# Altium schematic sheet CrawlerSch26_04_22 2.SchDoc
size D; SheetNumber: 1; SheetTotal: 1
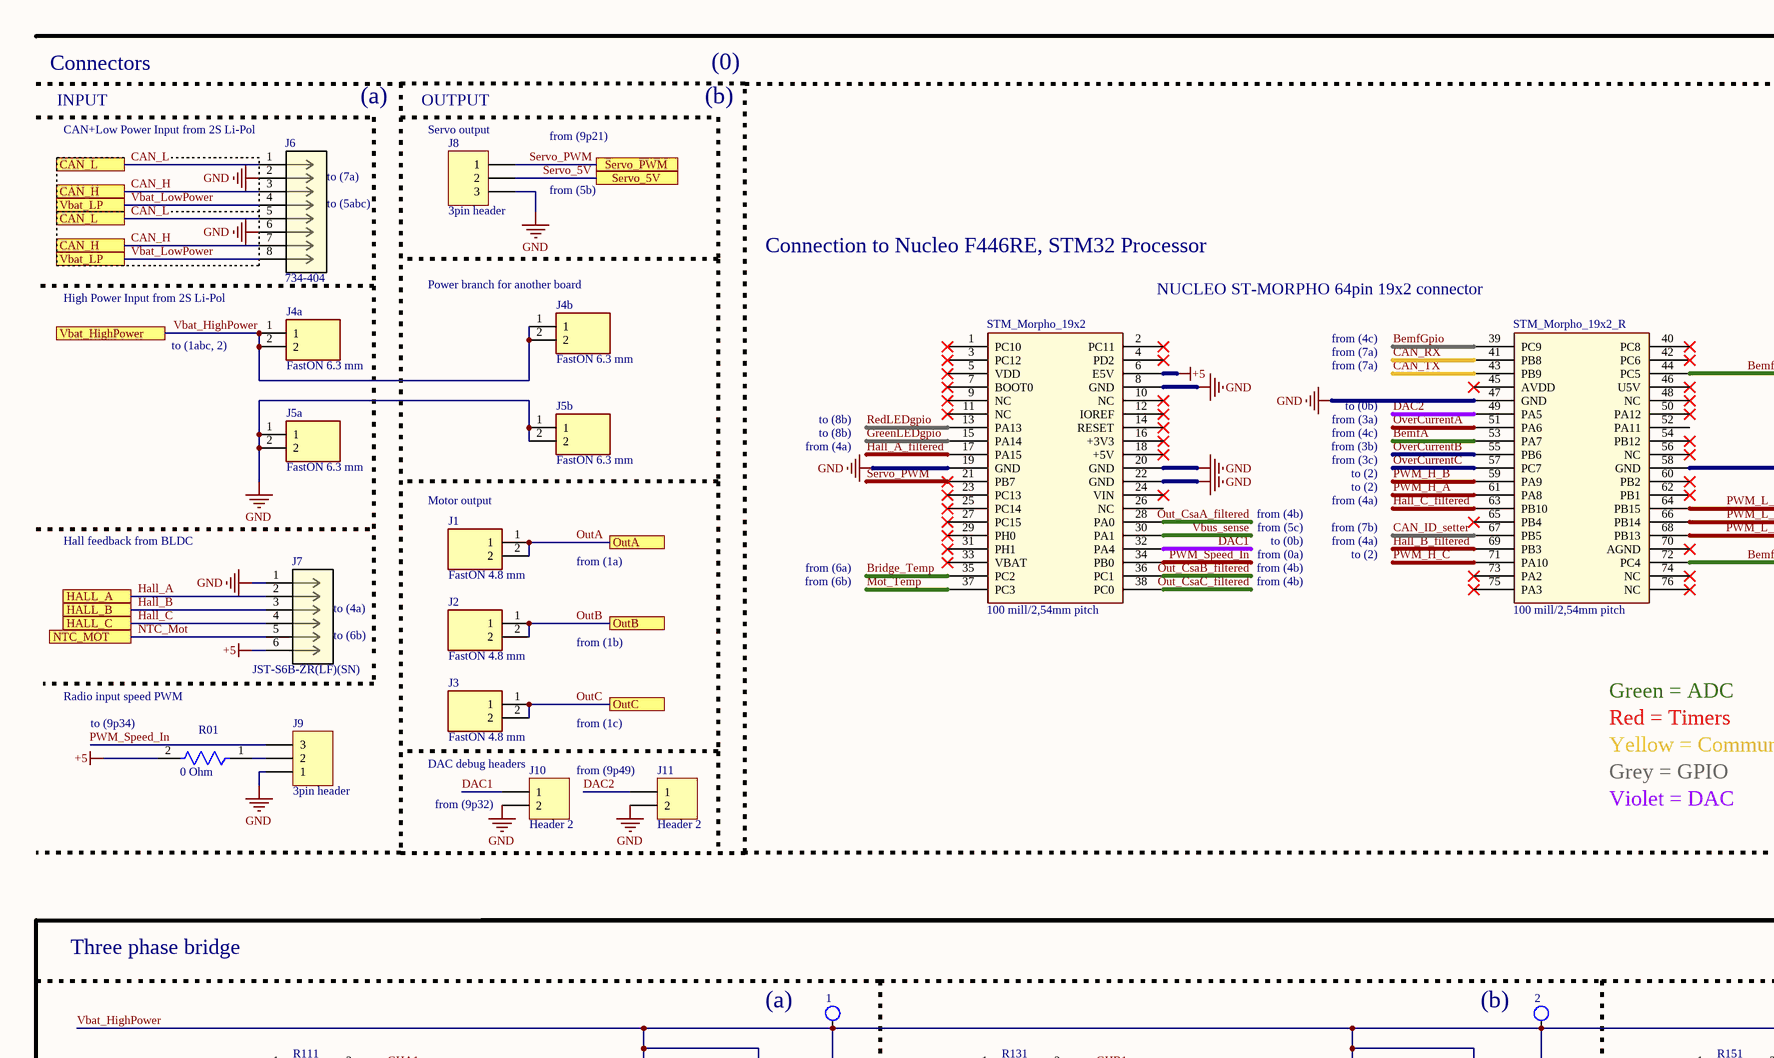
[diagram p0: CrawlerSch26_04_22 2.SchDoc, top left]
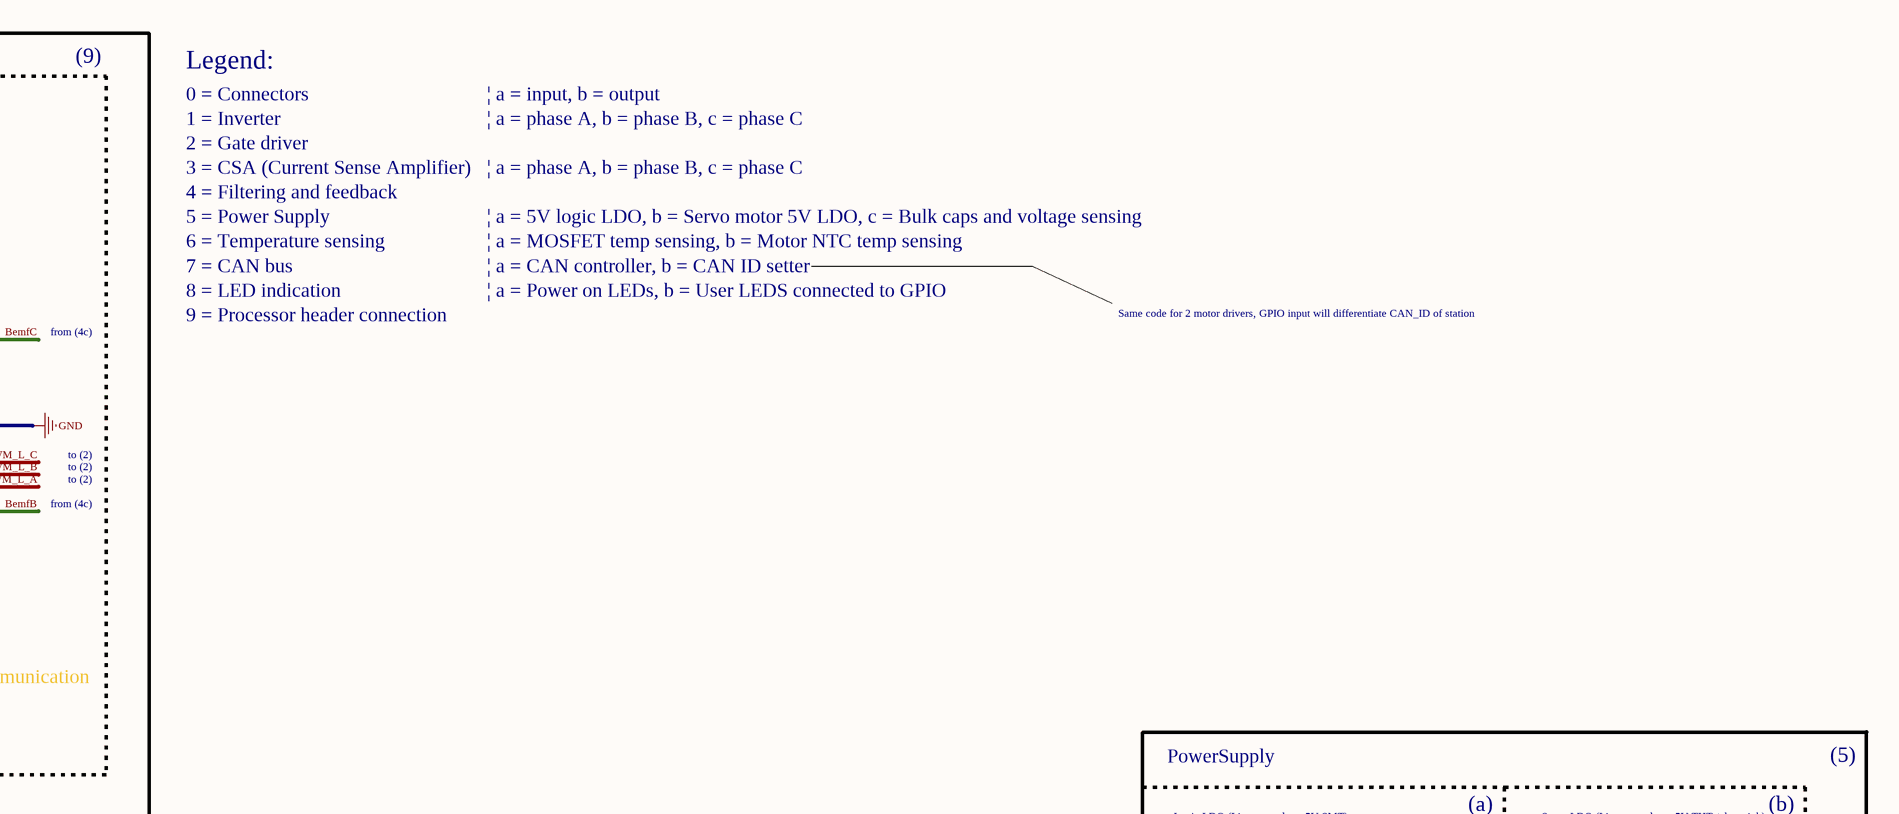
[diagram p1: CrawlerSch26_04_22 2.SchDoc, top right]
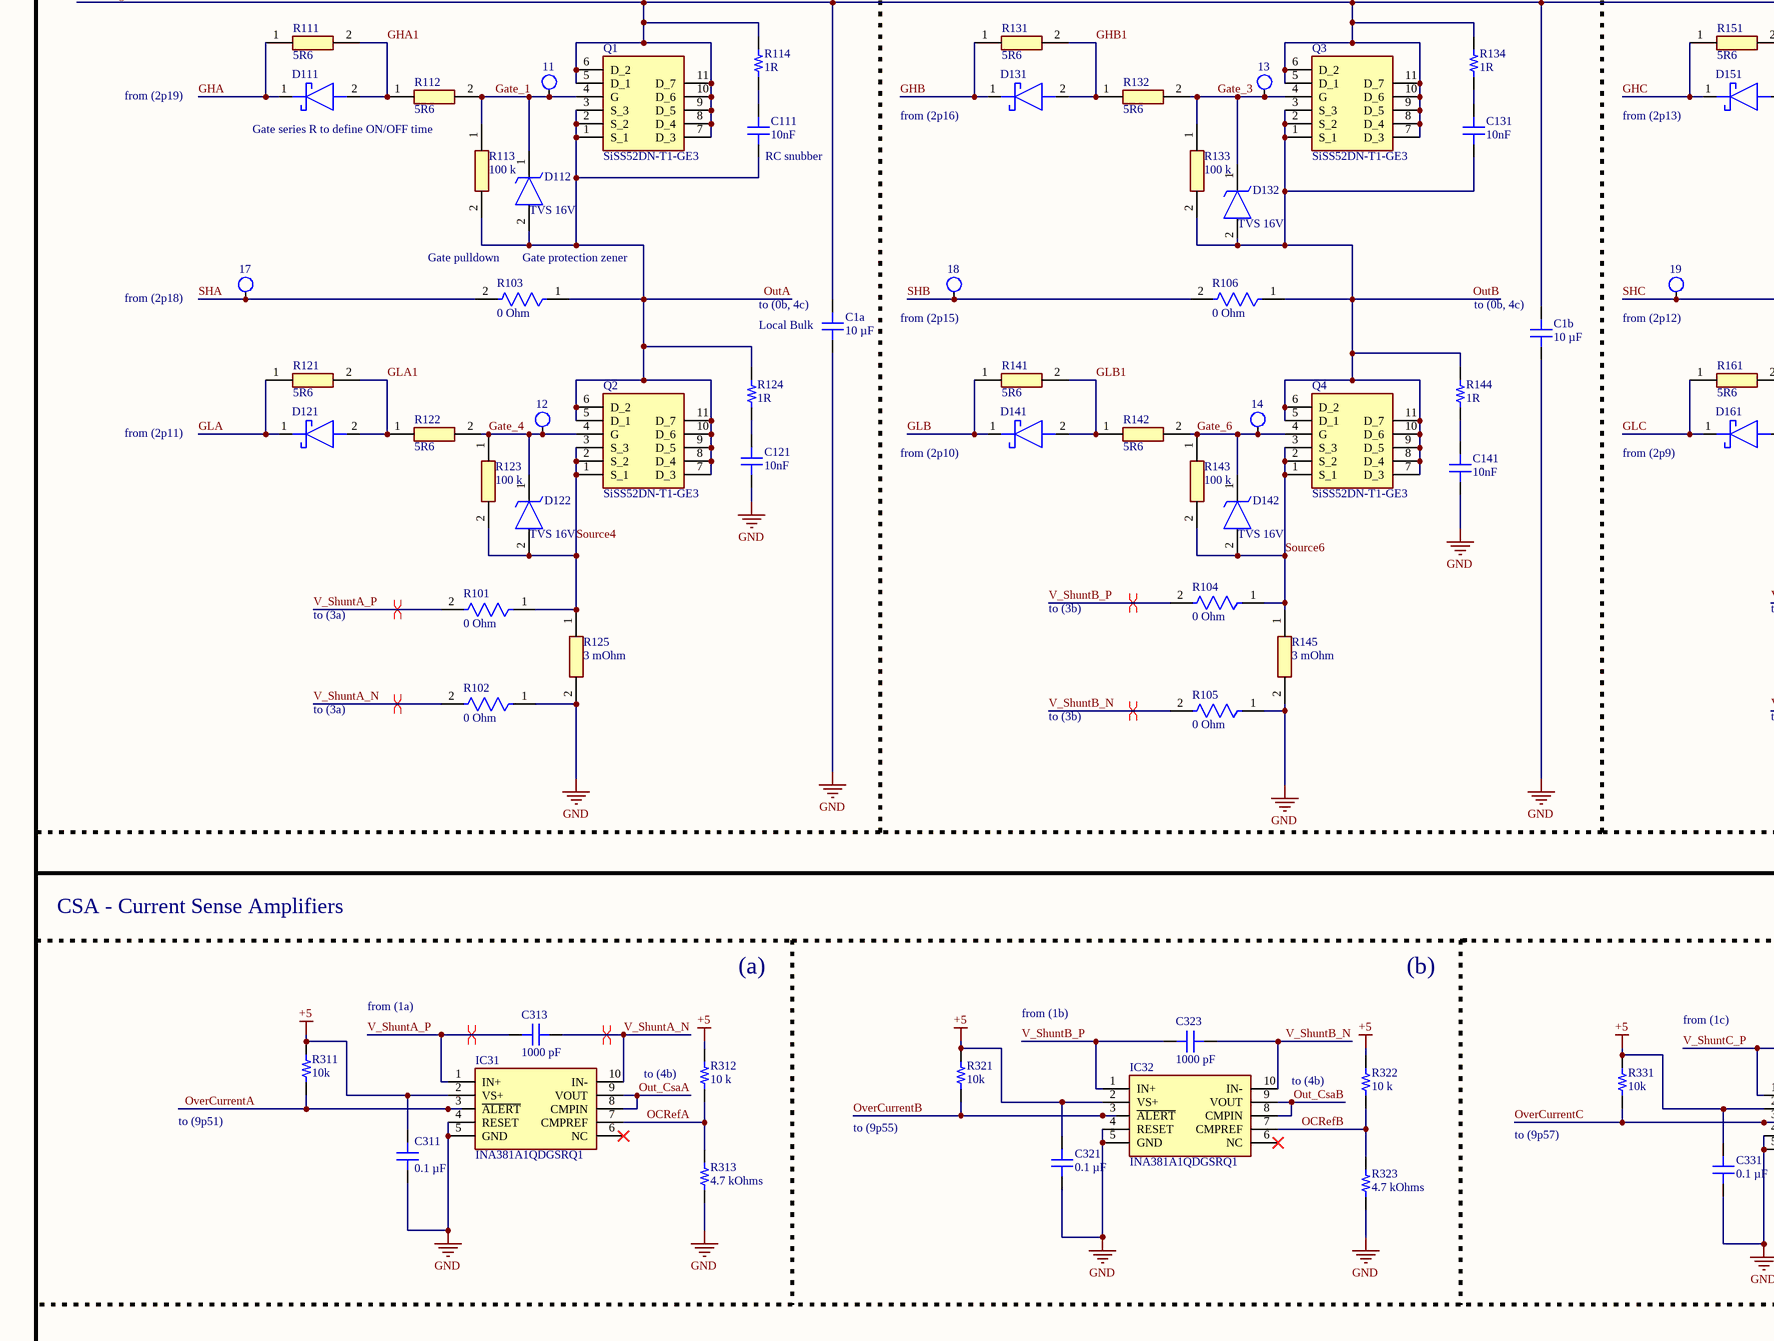
[diagram p2: CrawlerSch26_04_22 2.SchDoc, bottom left]
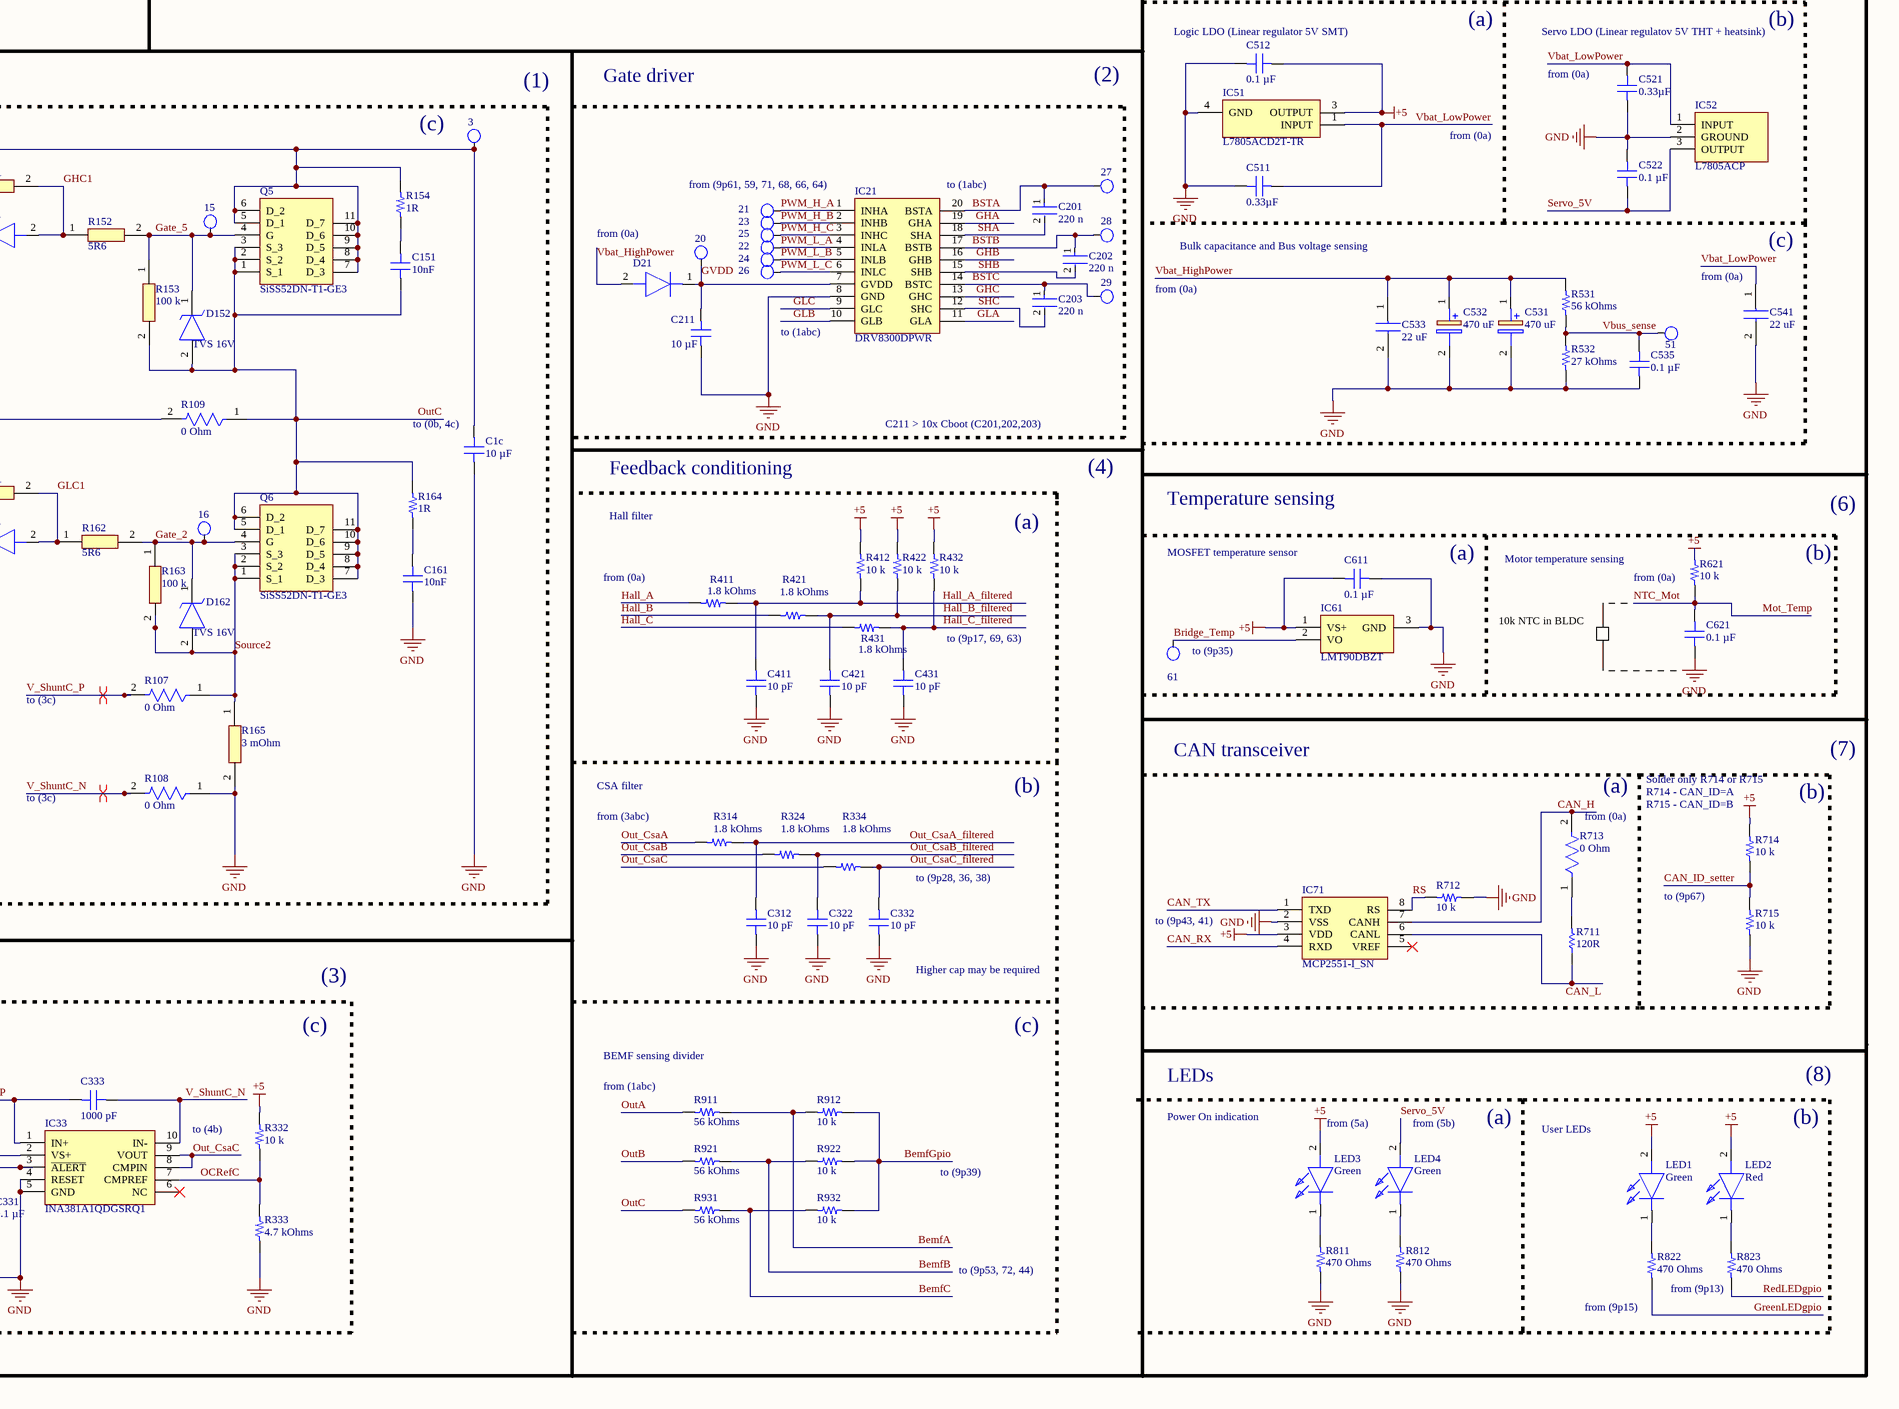
[diagram p3: CrawlerSch26_04_22 2.SchDoc, bottom right]

## Parts
1  TestPad  [TestPad]  (value not drawn)
2  TestPad  [TestPad]  (value not drawn)
3  TestPad  [TestPad]  (value not drawn)
11  TestPad  [TestPad]  (value not drawn)
12  TestPad  [TestPad]  (value not drawn)
13  TestPad  [TestPad]  (value not drawn)
14  TestPad  [TestPad]  (value not drawn)
15  TestPad  [TestPad]  (value not drawn)
16  TestPad  [TestPad]  (value not drawn)
17  TestPad  [TestPad]  (value not drawn)
18  TestPad  [TestPad]  (value not drawn)
19  TestPad  [TestPad]  (value not drawn)
20  TestPad  [TestPad]  (value not drawn)
21  TestPad  [TestPad]  (value not drawn)
22  TestPad  [TestPad]  (value not drawn)
23  TestPad  [TestPad]  (value not drawn)
24  TestPad  [TestPad]  (value not drawn)
25  TestPad  [TestPad]  (value not drawn)
26  TestPad  [TestPad]  (value not drawn)
27  TestPad  [TestPad]  (value not drawn)
28  TestPad  [TestPad]  (value not drawn)
29  TestPad  [TestPad]  (value not drawn)
51  TestPad  [TestPad]  (value not drawn)
61  TestPad  [TestPad]  (value not drawn)
C1a  10 µF  [CAP 0805_2012]
C1b  10 µF  [CAP 0805_2012]
C1c  10 µF  [CAP 0805_2012]
C111  10nF  [CAP 0805_2012]
C121  10nF  [CAP 0805_2012]
C131  10nF  [CAP 0805_2012]
C141  10nF  [CAP 0805_2012]
C151  10nF  [CAP 0805_2012]
C161  10nF  [CAP 0805_2012]
C201  220 n  [FP-CC0603-DA-MFG]
C202  220 n  [FP-CC0603-DA-MFG]
C203  220 n  [FP-CC0603-DA-MFG]
C211  10 µF  [CAP 0805_2012]
C311  value 0.1 µF  [CAP 0805_2012]
C312  10 pF  [CAP 0805_2012]
C313  1000 pF  [CAP 0805_2012]
C321  value 0.1 µF  [CAP 0805_2012]
C322  10 pF  [CAP 0805_2012]
C323  1000 pF  [CAP 0805_2012]
C331  value 0.1 µF  [CAP 0805_2012]
C332  10 pF  [CAP 0805_2012]
C333  1000 pF  [CAP 0805_2012]
C411  10 pF  [CAP 0805_2012]
C421  10 pF  [CAP 0805_2012]
C431  10 pF  [CAP 0805_2012]
C511  0.33µF  [CAP 0805_2012]
C512  value 0.1 µF  [CAP 0805_2012]
C521  0.33µF  [CAP 0805_2012]
C522  value 0.1 µF  [CAP 0805_2012]
C531  470 uF  [CAPPRD350W60D825H1300]
C532  470 uF  [CAPPRD350W60D825H1300]
C533  22 uF  [CAPC2012X145N]
C535  value 0.1 µF  [CAP 0805_2012]
C541  22 uF  [CAPC2012X145N]
C611  value 0.1 µF  [CAP 0805_2012]
C621  value 0.1 µF  [CAP 0805_2012]
D21  (no value)  [DIOM5226X220N]
D111  (no value)  [CUHS20F30H3F]
D112  TVS 16V  [SODFL1608X70N]
D121  (no value)  [CUHS20F30H3F]
D122  TVS 16V  [SODFL1608X70N]
D131  (no value)  [CUHS20F30H3F]
D132  TVS 16V  [SODFL1608X70N]
D141  (no value)  [CUHS20F30H3F]
D142  TVS 16V  [SODFL1608X70N]
D151  (no value)  [CUHS20F30H3F]
D152  TVS 16V  [SODFL1608X70N]
D161  (no value)  [CUHS20F30H3F]
D162  TVS 16V  [SODFL1608X70N]
IC21  DRV8300DPWR  [SOP65P640X120-20N]
IC31  INA381A1QDGSRQ1  [SOP50P490X110-10N]
IC32  INA381A1QDGSRQ1  [SOP50P490X110-10N]
IC33  INA381A1QDGSRQ1  [SOP50P490X110-10N]
IC51  L7805ACD2T-TR  [D2PAK-STB35NF10T4]
IC52  L7805ACP  [TO255P460X1020X2030-3P]
IC61  LMT90DBZT  [SOT95P237X112-3N]
IC71  MCP2551-I_SN  [SOIC127P600X175-8N]
J1  FastON 4.8 mm  [12171561]
J2  FastON 4.8 mm  [12171561]
J3  FastON 4.8 mm  [12171561]
J4a  FastON 6.3 mm  [7263872]
J4b  FastON 6.3 mm  [7263872]
J5a  FastON 6.3 mm  [7263872]
J5b  FastON 6.3 mm  [7263872]
J6  734-404  [CONN8_734-404_WAG]
J7  JST-S6B-ZR(LF)(SN)  [JST-ZH-S6B]
J8  3pin header  [HDR1X3]
J9  3pin header  [HDR1X3]
J10  Header 2  [HDR1X2]
J11  Header 2  [HDR1X2]
LED1  Green  [LEDC1608X80N]
LED2  Red  [LEDC1608X80N]
LED3  Green  [LEDC1608X80N]
LED4  Green  [LEDC1608X80N]
Q1  SiSS52DN-T1-GE3  [SISS94DNT1GE3]
Q2  SiSS52DN-T1-GE3  [SISS94DNT1GE3]
Q3  SiSS52DN-T1-GE3  [SISS94DNT1GE3]
Q4  SiSS52DN-T1-GE3  [SISS94DNT1GE3]
Q5  SiSS52DN-T1-GE3  [SISS94DNT1GE3]
Q6  SiSS52DN-T1-GE3  [SISS94DNT1GE3]
R01  0 Ohm  [FP-CR0805-IPC_C]
R101  0 Ohm  [FP-CR0805-IPC_C]
R102  0 Ohm  [FP-CR0805-IPC_C]
R103  0 Ohm  [FP-CR0805-IPC_C]
R104  0 Ohm  [FP-CR0805-IPC_C]
R105  0 Ohm  [FP-CR0805-IPC_C]
R106  0 Ohm  [FP-CR0805-IPC_C]
R107  0 Ohm  [FP-CR0805-IPC_C]
R108  0 Ohm  [FP-CR0805-IPC_C]
R109  0 Ohm  [FP-CR0805-IPC_C]
R111  5R6  [ERJP06_(0805)]
R112  5R6  [ERJP06_(0805)]
R113  100 k  [RESC2012X50N]
R114  1R  [RES 0805_2012]
R121  5R6  [ERJP06_(0805)]
R122  5R6  [ERJP06_(0805)]
R123  100 k  [RESC2012X50N]
R124  1R  [RES 0805_2012]
R125  3 mOhm  [RESC6434X90N]
R131  5R6  [ERJP06_(0805)]
R132  5R6  [ERJP06_(0805)]
R133  100 k  [RESC2012X50N]
R134  1R  [RES 0805_2012]
R141  5R6  [ERJP06_(0805)]
R142  5R6  [ERJP06_(0805)]
R143  100 k  [RESC2012X50N]
R144  1R  [RES 0805_2012]
R145  3 mOhm  [RESC6434X90N]
R151  5R6  [ERJP06_(0805)]
R152  5R6  [ERJP06_(0805)]
R153  100 k  [RESC2012X50N]
R154  1R  [RES 0805_2012]
R161  5R6  [ERJP06_(0805)]
R162  5R6  [ERJP06_(0805)]
R163  100 k  [RESC2012X50N]
R164  1R  [RES 0805_2012]
R165  3 mOhm  [RESC6434X90N]
R311  10k  [RES 0805_2012]
R312  10 k  [RES 0805_2012]
R313  4.7 kOhms  [RES 0805_2012]
R314  1.8 kOhms  [RES 0805_2012]
R321  10k  [RES 0805_2012]
R322  10 k  [RES 0805_2012]
R323  4.7 kOhms  [RES 0805_2012]
R324  1.8 kOhms  [RES 0805_2012]
R331  10k  [RES 0805_2012]
R332  10 k  [RES 0805_2012]
R333  4.7 kOhms  [RES 0805_2012]
R334  1.8 kOhms  [RES 0805_2012]
R411  1.8 kOhms  [RES 0805_2012]
R412  10 k  [RES 0805_2012]
R421  1.8 kOhms  [RES 0805_2012]
R422  10 k  [RES 0805_2012]
R431  1.8 kOhms  [RES 0805_2012]
R432  10 k  [RES 0805_2012]
R531  56 kOhms  [RES 0805_2012]
R532  27 kOhms  [RES 0805_2012]
R621  10 k  [RES 0805_2012]
R711  120R  [RESC0805(2012)_M]
R712  10 k  [RES 0805_2012]
R713  0 Ohm  [FP-CR0805-IPC_C]
R714  10 k  [RES 0805_2012]
R715  10 k  [RES 0805_2012]
R811  470 Ohms  [RES 0805_2012]
R812  470 Ohms  [RES 0805_2012]
R822  470 Ohms  [RES 0805_2012]
R823  470 Ohms  [RES 0805_2012]
R911  56 kOhms  [RES 0805_2012]
R912  10 k  [RES 0805_2012]
R921  56 kOhms  [RES 0805_2012]
R922  10 k  [RES 0805_2012]
R931  56 kOhms  [RES 0805_2012]
R932  10 k  [RES 0805_2012]
STM_Morpho_19x2  100 mill/2,54mm pitch  [STM_Morpho19x2_L]
STM_Morpho_19x2_R  100 mill/2,54mm pitch  [STM_Morpho19x2_R]

## Ports
CAN_H, CAN_L, HALL_A, HALL_B, HALL_C, NTC_MOT, OutA, OutB, OutC, Servo_5V, Servo_PWM, Vbat_HighPower, Vbat_LP

## Nets
+5: C311.2 C321.2 C331.2 C512.2 C611.2 IC31.2(VS+) IC32.2(VS+) IC33.2(VS+) IC51.3(OUTPUT) IC61.1(VS+) IC71.3(VDD) J7.6 LED1.2(A) LED2.2(A) LED3.2(A) R01.2 R311.2 R312.2 R321.2 R322.2 R331.2 R332.2 R412.2 R422.2 R432.2 R621.2 R714.2 STM_Morpho_19x2.6(E5V)
GND: C1a.1 C1b.1 C1c.1 C121.1 C141.1 C161.1 C211.2 C311.1 C312.1 C321.1 C322.1 C331.1 C332.1 C411.1 C421.1 C431.1 C511.1 C512.1 C521.1 C522.2 C531.2(-) C532.2(-) C533.2 C535.1 C541.2 C611.1 C621.1 IC21.8(GND) IC31.4(RESET) IC31.5(GND) IC32.4(RESET) IC32.5(GND) IC33.4(RESET) IC33.5(GND) IC51.4(GND) IC52.2(GROUND) IC61.3(GND) IC71.2(VSS) J5a.1 J5a.2 J5b.1 J5b.2 J6.2 J6.6 J7.1 J8.3 J9.1 J10.2 J11.2 R102.1 R105.1 R108.1 R125.2 R145.2 R165.2 R313.1 R323.1 R333.1 R532.1 R712.2 R715.1 R811.1 R812.1 STM_Morpho_19x2.8(GND) STM_Morpho_19x2.19(GND) STM_Morpho_19x2.20(GND) STM_Morpho_19x2.22(GND) STM_Morpho_19x2_R.47(GND) STM_Morpho_19x2_R.58(GND)
BemfA: R911.2 R912.1 STM_Morpho_19x2_R.53(PA7)
BemfB: R921.2 R922.1 STM_Morpho_19x2_R.72(PC4)
BemfC: R931.2 R932.1 STM_Morpho_19x2_R.44(PC5)
BemfGpio: R912.2 R922.2 R932.2 STM_Morpho_19x2_R.39(PC9)
Bridge_Temp: 61.1 IC61.2(VO) STM_Morpho_19x2.35(PC2)
BSTA: 27.1 C201.1 IC21.20(BSTA)
BSTB: 28.1 C202.1 IC21.17(BSTB)
BSTC: 29.1 C203.1 IC21.14(BSTC)
CAN_H: IC71.7(CANH) J6.3 J6.7 R713.2 ; port CAN_H
CAN_ID_setter: R714.1 R715.2 STM_Morpho_19x2_R.67(PB5)
CAN_L: IC71.6(CANL) J6.1 J6.5 R711.1 ; port CAN_L
CAN_RX: IC71.4(RXD) STM_Morpho_19x2_R.41(PB8)
CAN_TX: IC71.1(TXD) STM_Morpho_19x2_R.43(PB9)
DAC1: J10.1 STM_Morpho_19x2.32(PA4)
DAC2: J11.1 STM_Morpho_19x2_R.49(PA5)
Gate_1: 11.1 D112.1(K) Q1.4(G) R112.2 R113.1
Gate_2: 16.1 D162.1(K) Q6.4(G) R162.2 R163.1
Gate_3: 13.1 D132.1(K) Q3.4(G) R132.2 R133.1
Gate_4: 12.1 D122.1(K) Q2.4(G) R122.2 R123.1
Gate_5: 15.1 D152.1(K) Q5.4(G) R152.2 R153.1
Gate_6: 14.1 D142.1(K) Q4.4(G) R142.2 R143.1
GHA: D111.1(K) IC21.19(GHA) R111.1
GHA1: D111.2(A) R111.2 R112.1
GHB: D131.1(K) IC21.16(GHB) R131.1
GHB1: D131.2(A) R131.2 R132.1
GHC: D151.1(K) IC21.13(GHC) R151.1
GHC1: D151.2(A) R151.2 R152.1
GLA: D121.1(K) IC21.11(GLA) R121.1
GLA1: D121.2(A) R121.2 R122.1
GLB: D141.1(K) IC21.10(GLB) R141.1
GLB1: D141.2(A) R141.2 R142.1
GLC: D161.1(K) IC21.9(GLC) R161.1
GLC1: D161.2(A) R161.2 R162.1
GreenLEDgpio: R822.1 STM_Morpho_19x2.15(PA14)
GVDD: 20.1 C211.1 D21.1(K) IC21.7(GVDD)
Hall_A: J7.2 R411.1 ; port HALL_A
Hall_A_filtered: C411.2 R411.2 R412.1 STM_Morpho_19x2.17(PA15)
Hall_B: J7.3 R421.1 ; port HALL_B
Hall_B_filtered: C421.2 R421.2 R422.1 STM_Morpho_19x2_R.69(PB3)
Hall_C: J7.4 R431.1 ; port HALL_C
Hall_C_filtered: C431.2 R431.2 R432.1 STM_Morpho_19x2_R.63(PB10)
Mot_Temp: C621.2 J7.5 R621.1 STM_Morpho_19x2.37(PC3) ; port NTC_MOT  [also labelled NTC_Mot]
OCRefA: IC31.7(CMPREF) R312.1 R313.2
OCRefB: IC32.7(CMPREF) R322.1 R323.2
OCRefC: IC33.7(CMPREF) R332.1 R333.2
Out_CsaA: IC31.8(CMPIN) IC31.9(VOUT) R314.1
Out_CsaA_filtered: C312.2 R314.2 STM_Morpho_19x2.28(PA0)
Out_CsaB: IC32.8(CMPIN) IC32.9(VOUT) R324.1
Out_CsaB_filtered: C322.2 R324.2 STM_Morpho_19x2.36(PC1)
Out_CsaC: IC33.8(CMPIN) IC33.9(VOUT) R334.1
Out_CsaC_filtered: C332.2 R334.2 STM_Morpho_19x2.38(PC0)
OutA: C111.1 D112.2(A) J1.1 J1.2 Q1.1(S_1) Q1.2(S_2) Q1.3(S_3) Q2.5(D_1) Q2.6(D_2) Q2.7(D_3) Q2.8(D_4) Q2.9(D_5) Q2.10(D_6) Q2.11(D_7) R103.1 R113.2 R124.2 R911.1 ; port OutA
OutB: C131.1 D132.2(A) J2.1 J2.2 Q3.1(S_1) Q3.2(S_2) Q3.3(S_3) Q4.5(D_1) Q4.6(D_2) Q4.7(D_3) Q4.8(D_4) Q4.9(D_5) Q4.10(D_6) Q4.11(D_7) R106.1 R133.2 R144.2 R921.1 ; port OutB
OutC: C151.1 D152.2(A) J3.1 J3.2 Q5.1(S_1) Q5.2(S_2) Q5.3(S_3) Q6.5(D_1) Q6.6(D_2) Q6.7(D_3) Q6.8(D_4) Q6.9(D_5) Q6.10(D_6) Q6.11(D_7) R109.1 R153.2 R164.2 R931.1 ; port OutC
OverCurrentA: IC31.3(~{ALERT}) R311.1 STM_Morpho_19x2_R.51(PA6)
OverCurrentB: IC32.3(~{ALERT}) R321.1 STM_Morpho_19x2_R.55(PB6)
OverCurrentC: IC33.3(~{ALERT}) R331.1 STM_Morpho_19x2_R.57(PC7)
PWM_H_A: 21.1 IC21.1(INHA) STM_Morpho_19x2_R.61(PA8)
PWM_H_B: 23.1 IC21.2(INHB) STM_Morpho_19x2_R.59(PA9)
PWM_H_C: 25.1 IC21.3(INHC) STM_Morpho_19x2_R.71(PA10)
PWM_L_A: 22.1 IC21.4(INLA) STM_Morpho_19x2_R.68(PB13)
PWM_L_B: 24.1 IC21.5(INLB) STM_Morpho_19x2_R.66(PB14)
PWM_L_C: 26.1 IC21.6(INLC) STM_Morpho_19x2_R.64(PB15)
PWM_Speed_In: J9.3 STM_Morpho_19x2.34(PB0)
RedLEDgpio: R823.1 STM_Morpho_19x2.13(PA13)
RS: IC71.8(RS) R712.1
Servo_5V: C522.1 IC52.3(OUTPUT) J8.2 LED4.2(A) ; port Servo_5V
Servo_PWM: J8.1 STM_Morpho_19x2.21(PB7) ; port Servo_PWM
SHA: 17.1 C201.2 IC21.18(SHA) R103.2
SHB: 18.1 C202.2 IC21.15(SHB) R106.2
SHC: 19.1 C203.2 IC21.12(SHC) R109.2
Source2: D162.2(A) Q6.1(S_1) Q6.2(S_2) Q6.3(S_3) R107.1 R163.2 R165.1
Source4: D122.2(A) Q2.1(S_1) Q2.2(S_2) Q2.3(S_3) R101.1 R123.2 R125.1
Source6: D142.2(A) Q4.1(S_1) Q4.2(S_2) Q4.3(S_3) R104.1 R143.2 R145.1
V_ShuntA_N: C313.1 IC31.10(IN-) R102.2
V_ShuntA_P: C313.2 IC31.1(IN+) R101.2
V_ShuntB_N: C323.1 IC32.10(IN-) R105.2
V_ShuntB_P: C323.2 IC32.1(IN+) R104.2
V_ShuntC_N: C333.1 IC33.10(IN-) R108.2
V_ShuntC_P: C333.2 IC33.1(IN+) R107.2
Vbat_HighPower: 1.1 2.1 3.1 C1a.2 C1b.2 C1c.2 C531.1(+) C532.1(+) C533.1 D21.2(A) J4a.1 J4a.2 J4b.1 J4b.2 Q1.5(D_1) Q1.6(D_2) Q1.7(D_3) Q1.8(D_4) Q1.9(D_5) Q1.10(D_6) Q1.11(D_7) Q3.5(D_1) Q3.6(D_2) Q3.7(D_3) Q3.8(D_4) Q3.9(D_5) Q3.10(D_6) Q3.11(D_7) Q5.5(D_1) Q5.6(D_2) Q5.7(D_3) Q5.8(D_4) Q5.9(D_5) Q5.10(D_6) Q5.11(D_7) R114.2 R134.2 R154.2 R531.2 ; port Vbat_HighPower
Vbat_LowPower: C511.2 C521.2 C541.1 IC51.1(INPUT) IC52.1(INPUT) J6.4 J6.8 ; port Vbat_LP
Vbus_sense: 51.1 C535.2 R531.1 R532.2 STM_Morpho_19x2.30(PA1)
NetC111_2: C111.2 R114.1
NetC121_2: C121.2 R124.1
NetC131_2: C131.2 R134.1
NetC141_2: C141.2 R144.1
NetC151_2: C151.2 R154.1
NetC161_2: C161.2 R164.1
NetJ9_2: J9.2 R01.1
NetLED1_1: LED1.1(K) R822.2
NetLED2_1: LED2.1(K) R823.2
NetLED3_1: LED3.1(K) R811.2
NetLED4_1: LED4.1(K) R812.2
NetR711_2: R711.2 R713.1

Not connected (* = marked no-connect by the designer): IC31 6(NC)*; IC32 6(NC)*; IC33 6(NC)*; IC71 5(VREF)*; STM_Morpho_19x2 1(PC10)* 2(PC11)* 3(PC12)* 4(PD2)* 5(VDD)* 7(BOOT0)* 9(NC)* 10(NC)* 11(NC)* 12(IOREF)* 14(RESET)* 16(+3V3)* 18(+5V)* 23(PC13)* 24(VIN)* 25(PC14)* 26(NC) 27(PC15)* 29(PH0)* 31(PH1)* 33(VBAT)*; STM_Morpho_19x2_R 40(PC8)* 42(PC6)* 45(AVDD)* 46(U5V)* 48(NC)* 50(PA12)* 52(PA11) 54(PB12)* 56(NC)* 60(PB2)* 62(PB1)* 65(PB4)* 70(AGND)* 73(PA2)* 74(NC)* 75(PA3)* 76(NC)*

## Layout directives
differential pair: V_ShuntA_N, V_ShuntA_P, V_ShuntB_N, V_ShuntB_P, V_ShuntC_N, V_ShuntC_P

## Notes on the sheet
- Connectors
- (0)
- (9)
- Legend:
- INPUT
- (near J6) CAN+Low Power Input from 2S Li-Pol
- (a)
- OUTPUT
- (near J8) Servo output
- from (9p21)
- (b)
- 0 = Connectors
- 1 = Inverter
- | a = phase A, b = phase B, c = phase C
- | a = input, b = output
- (near J6) to (7a)
- (near J6) to (5abc)
- from (5b)
- 2 = Gate driver
- 3 = CSA (Current Sense Amplifier)
- 4 = Filtering and feedback
- (near J4b) Power branch for another board
- Connection to Nucleo F446RE, STM32 Processor
- NUCLEO ST-MORPHO 64pin 19x2 connector
- 5 = Power Supply
- 6 = Temperature sensing
- | a = 5V logic LDO, b = Servo motor 5V LDO, c = Bulk caps and voltage sensing
- | a = MOSFET temp sensing, b = Motor NTC temp sensing
- High Power Input from 2S Li-Pol
- (near J4a) to (1abc, 2)
- from (7a)
- from (4c)
- 7 = CAN bus
- 8 = LED indication
- 9 = Processor header connection
- | a = CAN controller, b = CAN ID setter
- | a = Power on LEDs, b = User LEDS connected to GPIO
- Same code for 2 motor drivers, GPIO input will differentiate CAN_ID of station
- to (8b)
- from (3a)
- to (0b)
- from (4a)
- from (3b)
- from (3c)
- to (2)
- Hall feedback from BLDC
- (near J1) Motor output
- from (1a)
- from (4b)
- from (5c)
- from (0a)
- from (7b)
- (near J7) to (4a)
- from (6b)
- from (6a)
- Radio input speed PWM
- (near J7) to (6b)
- from (1b)
- Green = ADC
- (near R01) to (9p34)
- from (1c)
- Red = Timers
- Yellow = Communication
- (near J10) DAC debug headers
- (near J10) from (9p32)
- (near J11) from (9p49)
- Grey = GPIO
- Violet = DAC
- PowerSupply
- (5)
- Three phase bridge
- (1)
- Gate driver
- (2)
- (near C512) Logic LDO (Linear regulator 5V SMT)
- (near C521) Servo LDO (Linear regulatov 5V THT + heatsink)
- (near C521) from (0a)
- (near 1) (a)
- (near 2) (b)
- (near 3) (c)
- from (9p61, 59, 71, 68, 66, 64)
- (near IC21) to (1abc)
- from (2p19)
- Gate series R to define ON/OFF time
- (near D131) from (2p16)
- (near D151) from (2p13)
- Bulk capacitance and Bus voltage sensing
- (c)
- (near C111) RC snubber
- (near C541) from (0a)
- Gate pulldown
- Gate protection zener
- from (2p18)
- (near C1a) Local Bulk
- (near C1a) to (0b, 4c)
- (near 18) from (2p15)
- (near C1b) to (0b, 4c)
- (near 19) from (2p12)
- (near C1c) to (0b, 4c)
- C211 > 10x Cboot (C201,202,203)
- Feedback conditioning
- Hall filter
- (4)
- Temperature sensing
- (6)
- from (2p11)
- (near D141) from (2p10)
- (near D161) from (2p9)
- MOSFET temperature sensor
- Motor temperature sensing
- (near R621) from (0a)
- to (9p17, 69, 63)
- 10k NTC in BLDC
- to (3a)
- to (3b)
- to (3c)
- (near 61) to (9p35)
- CAN transceiver
- (7)
- CSA filter
- from (3abc)
- (near R713) from (0a)
- (near R713) (a)
- Solder only R714 or R715
- (near R714) R714 - CAN_ID=A
- (near R714) R715 - CAN_ID=B
- to (9p28, 36, 38)
- to (9p43, 41)
- to (9p67)
- CSA - Current Sense Amplifiers
- (3)
- (near C332) Higher cap may be required
- BEMF sensing divider
- (near R312) to (4b)
- to (4b)
- (near R911) from (1abc)
- Power On indication
- LEDs
- from (5a)
- (near LED4) from (5b)
- User LEDs
- (8)
- to (9p51)
- to (9p55)
- to (9p57)
- to (9p39)
- to (9p53, 72, 44)
- (near R822) from (9p15)
- (near R823) from (9p13)

## Library data of the parts
C1a C1b C1c C211 = TMK212BBJ106KG-T: CAP CER 10UF 25V X5R 0805; manufacturer: Taiyo Yuden; Tolerance: ±10%; Part Number: TMK212BBJ106KG-T; Value: 10 µF; Applications: SMPS Filtering; Capacitance: 10 µF; componentlink1description: Datasheet; componentlink1url: https://www.yuden.co.jp/productdata/catalog/mlcc01_e.pdf; componentlink2description: DigiKey Link; componentlink2url: https://www.digikey.com/en/products/detail/taiyo-yuden/TMK212BBJ106KG-T/2714163; Device Package: 0805 (2012 Metric); lastupdated: 12.04.2022 22:11:08; Lifecycle Status: Active; Minimum Order: 1; Mounting Type: Surface Mount, MLCC; Operating Temperature: -55°C ~ 85°C; Package / Case: 0805 (2012 Metric); packaging: TapeAndReel; partid: 38853; Part Status: Active; price: 0.04; series: M; Size / Dimension: 0.079" L x 0.049" W (2.00mm x 1.25mm); Supplier 1: DigiKey; Supplier Part Number 1: 587-2985-1-ND; Temperature Coefficient: X5R; Thickness (Max): 0.053" (1.35mm); Voltage - Rated: 25V
C111 C121 C131 C141 C151 C161 = C0805C103J5GEC7210: CAP CER 0805 10NF 50V C0G 5%; manufacturer: KEMET; Capacitance: 10000 pF; Temperature Coefficient: C0G, NP0; Part Number: C0805C103J5GEC7210; Value: 10nF; Applications: ESD Protection; componentlink1description: Datasheet; componentlink1url: https://api.kemet.com/component-edge/download/datasheet/C0805C103J5GEC7210.pdf; componentlink2description: DigiKey Link; componentlink2url: https://www.digikey.com/en/products/detail/kemet/C0805C103J5GEC7210/8645966; Device Package: 0805 (2012 Metric); Features: Low ESL; lastupdated: 31.03.2022 8:49:11; Lifecycle Status: Active; Minimum Order: 1; Mounting Type: Surface Mount, MLCC; Operating Temperature: -55°C ~ 125°C; Package / Case: 0805 (2012 Metric); packaging: TapeAndReel; partid: 32892; Part Status: Active; price: 0.05; series: ESD SMD Comm C0G; Size / Dimension: 0.079" L x 0.049" W (2.00mm x 1.25mm); Supplier 1: DigiKey; Supplier Part Number 1: 399-C0805C103J5GEC7210CT-ND; Thickness (Max): 0.039" (1.00mm); Tolerance: ±5%; Voltage - Rated: 50V
C201-C203 = CMP-03422-000928-1: CAP CER 0.22UF 25V X5R 0603; Manufacturer: YAGEO; Manufacturer Part Number: CC0603KRX5R8BB224; Capacitance: 220 nF; Value: 220 nF; Material: Ceramic; Tolerance: 0.1; Temperature Coefficient: 15%; Voltage: 25 V; Package: CC0603-DA; Footprint Url: http://www.yageo.com/exep/pages/download/literatures/UPY-C_GEN_24.pdf; ComponentLink2Description: Datasheet; Lead Free: Yes; Device Class L2: Capacitors; Mouser Description: Multilayer Ceramic Capacitors MLCC - SMD/SMT 220 nF; Temperature Range Low: -55°C; Temperature Range High: +125°C; Temperature Characteristic: X5R; Device Class L1: Passive Components; Temperature: -55°C to +125°C; Voltage Rating: 25 V; RoHS: TRUE; Octopart: https://octopart.com/cc0603krx5r8bb224-yageo-29183069; Height: 0.9mm; Automotive: No; Device Class L3: Ceramic Capacitors; Category: Cap; ComponentLink2URL: http://www.yageo.com/documents/recent/UPY-GPHC_X7R_6.3V-to-50V_18.pdf; Digikey Description: CAP CER 0.22UF 25V X5R 0603
C311 C321 C331 C512 C522 C535 C611 C621 = 885012207045: CAP CER 0.1UF 16V X7R 0805; manufacturer: Würth Elektronik; Tolerance: ±10%; Part Number: 885012207045; Applications: General Purpose; Capacitance: 0.1 µF; componentlink1description: Datasheet; componentlink1url: https://katalog.we-online.de/pbs/datasheet/885012207045.pdf; componentlink2description: DigiKey Link; componentlink2url: https://www.digikey.com/en/products/detail/würth-elektronik/885012207045/5453900; Device Package: 0805 (2012 Metric); lastupdated: 12.04.2022 22:11:04; Lifecycle Status: Active; Minimum Order: 1; Mounting Type: Surface Mount, MLCC; Operating Temperature: -55°C ~ 125°C; Package / Case: 0805 (2012 Metric); packaging: TapeAndReel; partid: 15395; Part Status: Active; price: 0.03; series: WCAP-CSGP; Size / Dimension: 0.079" L x 0.049" W (2.00mm x 1.25mm); Supplier 1: DigiKey; Supplier Part Number 1: 732-8045-1-ND; Temperature Coefficient: X7R; Thickness (Max): 0.035" (0.90mm); Voltage - Rated: 16V
C312 C322 C332 C411 C421 C431 = 885012007010: CAP CER 10PF 16V C0G/NP0 0805; manufacturer: Würth Elektronik; Temperature Coefficient: C0G, NP0; Tolerance: ±5%; Part Number: 885012007010; Value: 10 pF; Applications: General Purpose; Capacitance: 10 pF; componentlink1description: Datasheet; componentlink1url: https://katalog.we-online.de/pbs/datasheet/885012007010.pdf; componentlink2description: DigiKey Link; componentlink2url: https://www.digikey.com/en/products/detail/würth-elektronik/885012007010/5453669; Device Package: 0805 (2012 Metric); lastupdated: 02.04.2022 5:58:15; Lifecycle Status: Active; Minimum Order: 1; Mounting Type: Surface Mount, MLCC; Operating Temperature: -55°C ~ 125°C; Package / Case: 0805 (2012 Metric); packaging: TapeAndReel; partid: 12597; Part Status: Active; price: 0.03; series: WCAP-CSGP; Size / Dimension: 0.079" L x 0.049" W (2.00mm x 1.25mm); Supplier 1: DigiKey; Supplier Part Number 1: 732-7814-1-ND; Thickness (Max): 0.053" (1.35mm); Voltage - Rated: 16V
C313 C323 C333 = 885012207033: CAP CER 1000PF 16V X7R 0805; manufacturer: Würth Elektronik; Tolerance: ±10%; Part Number: 885012207033; Value: 1000 pF; Applications: General Purpose; Capacitance: 1000 pF; componentlink1description: Datasheet; componentlink1url: https://katalog.we-online.de/pbs/datasheet/885012207033.pdf; componentlink2description: DigiKey Link; componentlink2url: https://www.digikey.com/en/products/detail/würth-elektronik/885012207033/5453888; Device Package: 0805 (2012 Metric); lastupdated: 12.04.2022 22:11:16; Lifecycle Status: Active; Minimum Order: 1; Mounting Type: Surface Mount, MLCC; Operating Temperature: -55°C ~ 125°C; Package / Case: 0805 (2012 Metric); packaging: TapeAndReel; partid: 12259; Part Status: Active; price: 0.02; series: WCAP-CSGP; Size / Dimension: 0.079" L x 0.049" W (2.00mm x 1.25mm); Supplier 1: DigiKey; Supplier Part Number 1: 732-8033-1-ND; Temperature Coefficient: X7R; Thickness (Max): 0.035" (0.90mm); Voltage - Rated: 16V
C511 C521 = 0805YC334JAT2A: CAP CER 0.33UF 16V X7R 0805; manufacturer: AVX Corporation; Tolerance: ±5%; Part Number: 0805YC334JAT2A; Value: 0.33µF; Applications: General Purpose; Capacitance: 0.33µF; componentlink1description: Datasheet; componentlink1url: http://datasheets.avx.com/X7RDielectric.pdf; componentlink2description: DigiKey Link; componentlink2url: http://digikey.com/product-detail/en/avx-corporation/0805YC334JAT2A/478-5273-1-ND/1950940; Device Package: 0805 (2012 Metric); lastupdated: 02.09.2020 1:04:40; Lifecycle Status: Active; Minimum Order: 1; Mounting Type: Surface Mount, MLCC; Operating Temperature: -55°C ~ 125°C; Package / Case: 0805 (2012 Metric); packaging: TapeAndReel; partid: 3309; Part Status: Active; price: 0.15; series: -; Size / Dimension: 0.079" L x 0.049" W (2.01mm x 1.25mm); Supplier 1: DigiKey; Supplier Part Number 1: 478-5273-1-ND; Temperature Coefficient: X7R; Thickness (Max): 0.055" (1.40mm); Voltage - Rated: 16V
C531 C532 = RNE1C471MDN1: Capacitor Polarised; Manufacturer_Name: Nichicon; Datasheet Link: https://g.componentsearchengine.com/Datasheets/1/RNE1C471MDN1.pdf; Height: 13mm; Manufacturer_Part_Number: RNE1C471MDN1
C533 C541 = CL21A226MAYNNNE: Capacitor; Manufacturer_Name: Samsung; Datasheet Link: http://product.samsungsem.com/mlcc/CL21A226MAYNNN.do; Height: 1.45mm; Manufacturer_Part_Number: CL21A226MAYNNNE
D21 = NRVA4003T3G: Diode; Manufacturer_Name: ON Semiconductor; Height: 2.2mm; Manufacturer_Part_Number: NRVA4003T3G
D111 D121 D131 D141 D151 D161 = CUHS20F30,H3F: Schottky Diode; Manufacturer_Name: Toshiba; Datasheet Link: https://toshiba.semicon-storage.com/info/docget.jsp?did=63604&prodName=CUHS20F30; Height: 0.68mm; Manufacturer_Part_Number: CUHS20F30,H3F
D112 D122 D132 D142 D152 D162 = ESDA18-1K: TVS Diode (Uni-directional); Manufacturer_Name: STMicroelectronics; Datasheet Link: https://componentsearchengine.com/Datasheets/1/ESDA18-1K.pdf; Height: 0.7mm; Manufacturer_Part_Number: ESDA18-1K; ComponentLink1Description: Mouser; ComponentLink1URL: https://cz.mouser.com/ProductDetail/onsemi/NRVA4003T3G?qs=tCMd4XlZ%2FiDP1uXXxJRcew%3D%3D
IC21 = DRV8300DIPWR: Integrated Circuit; Manufacturer_Name: Texas Instruments; Datasheet Link: https://www.ti.com/lit/gpn/drv8300?HQS=ti-null-null-sf-df-pf-sep-wwe&DCM=yes; Height: 1.2mm; Manufacturer_Part_Number: DRV8300DIPWR
IC31-IC33 = INA381A1QDGSRQ1: Integrated Circuit; Manufacturer_Name: Texas Instruments; Datasheet Link: https://www.ti.com/lit/ds/symlink/ina381-q1.pdf?ts=1628248129123&ref_url=https%253A%252F%252Fwww.google.com%252F; Height: 1.1mm; Manufacturer_Part_Number: INA381A1QDGSRQ1
IC51 = L7805ACD2T-TR: D2pak SMT; Manufacturer_Name: STMicroelectronics; Datasheet Link: http://www.st.com/web/en/resource/technical/document/datasheet/CD00000444.pdf; Manufacturer_Part_Number: L7805ACD2T-TR
IC52 = L7805ACP: TO-220 THT; Manufacturer_Name: STMicroelectronics; Datasheet Link: http://www.st.com/web/en/resource/technical/document/datasheet/CD00000444.pdf; Height: 4.6mm; Manufacturer_Part_Number: L7805ACP
IC61 = LMT90DBZT: Temperature sensor; Manufacturer_Name: Texas Instruments; Datasheet Link: http://www.ti.com/lit/ds/symlink/lmt90.pdf; Height: 1.12mm; Manufacturer_Part_Number: LMT90DBZT
IC71 = MCP2551-I_SN: Integrated Circuit; Manufacturer_Name: Microchip; Manufacturer_Part_Number: MCP2551-I/SN; Datasheet Link: https://componentsearchengine.com//MCP2551-I_SN.pdf; Height: 1.75mm; Mouser2 Part Number: 579-MCP2551-I/SN; Mouser2 Price/Stock: https://www.mouser.com/Search/Refine.aspx?Keyword=579-MCP2551-I%2FSN
J1 = 1217156-1: Motor phase A output; Manufacturer_Name: TE Connectivity; Datasheet Link: https://www.te.com/commerce/DocumentDelivery/DDEController?Action=showdoc&DocId=Customer+Drawing%7F1217156%7FD%7Fpdf%7FEnglish%7FENG_CD_1217156_D_baseFilename.pdf%7F1217156-1; Height: 7.47mm; Manufacturer_Part_Number: 1217156-1
J2 = 1217156-1: Motor phase B output; Manufacturer_Name: TE Connectivity; Datasheet Link: https://www.te.com/commerce/DocumentDelivery/DDEController?Action=showdoc&DocId=Customer+Drawing%7F1217156%7FD%7Fpdf%7FEnglish%7FENG_CD_1217156_D_baseFilename.pdf%7F1217156-1; Height: 7.47mm; Manufacturer_Part_Number: 1217156-1
J3 = 1217156-1: Motor phase C output; Manufacturer_Name: TE Connectivity; Datasheet Link: https://www.te.com/commerce/DocumentDelivery/DDEController?Action=showdoc&DocId=Customer+Drawing%7F1217156%7FD%7Fpdf%7FEnglish%7FENG_CD_1217156_D_baseFilename.pdf%7F1217156-1; Height: 7.47mm; Manufacturer_Part_Number: 1217156-1
J4a J4b = 726387-2: 2S battery power input +; Manufacturer_Name: TE Connectivity; Datasheet Link: https://www.te.com/commerce/DocumentDelivery/DDEController?Action=showdoc&DocId=Customer+Drawing%7F726387%7FD2%7Fpdf%7FEnglish%7FENG_CD_726387_D2.pdf%7F726387-2; Height: 15mm; Manufacturer_Part_Number: 726387-2
J5a J5b = 726387-2: 2S battery power input -; Manufacturer_Name: TE Connectivity; Datasheet Link: https://www.te.com/commerce/DocumentDelivery/DDEController?Action=showdoc&DocId=Customer+Drawing%7F726387%7FD2%7Fpdf%7FEnglish%7FENG_CD_726387_D2.pdf%7F726387-2; Height: 15mm; Manufacturer_Part_Number: 726387-2
J6 = 734-404: No Description Available; Mfr_Name: Wago; Copyright: Copyright (C) 2022 Ultra Librarian. All rights reserved.; Manufacturer_Part_Number: 734-404; RefDes: RefDes; Type: DEV
J8 J9 = Header 3: Servo output power and PWM; LatestRevisionDate: 17-Jul-2002; LatestRevisionNote: Re-released for DXP Platform.; Publisher: Altium Limited
J10 J11 = Header 2: Header, 2-Pin; LatestRevisionDate: 17-Jul-2002; LatestRevisionNote: Re-released for DXP Platform.; Publisher: Altium Limited
LED1-LED4 = 150060RS75000: LED; Manufacturer_Name: Wurth Elektronik; Datasheet Link: http://katalog.we-online.de/led/datasheet/150060RS75000.pdf; Height: 0.8mm; Manufacturer_Part_Number: 150060RS75000
Q1-Q6 = SiSS52DN-T1-GE3: MOSFET (N-Channel); Manufacturer_Name: Vishay; Datasheet Link: https://www.vishay.com/docs/79977/siss52dn.pdf; Height: 1.12mm; Manufacturer_Part_Number: SiSS52DN-T1-GE3
R01 R101-R109 R713 = CMP-07231-004348-1: Thick Film Chip Resistors 0805 0Ω 0.125W 5%; Voltage Rating: 150V; Max Power Dissipation: 125mW; Temperature Coefficient: 500ppm/°C; Resistance: 0mR; Min Operating Temperature: -55°C; Case Code (Metric): 2012; Height: 0.5mm; Contact Plating: Tin; Thickness: 508um; Military Standard: Not; Composition: Thick Film; REACH SVHC: No SVHC; Voltage Rating (DC): 150V; Length: 2mm; Radiation Hardening: No; Case/Package: 0805; Package Quantity: 5000; Number of Pins: 2; Max Operating Temperature: 155°C; Case Code (Imperial): 0805; Mount: Surface Mount; Depth: 1.25mm; Packaging: Tape and Reel; Tolerance: 5%; Termination: SMD/SMT; Width: 1.25mm; Power Rating: 125mW
R111 R112 R121 R122 R131 R132 R141 R142 R151 R152 R161 R162 = ERJ-P06J5R6V: Resistor; Manufacturer_Name: Panasonic; Datasheet Link: https://industrial.panasonic.com/cdbs/www-data/pdf/RDO0000/AOA0000C331.pdf; Height: 0.7mm; Manufacturer_Part_Number: ERJ-P06J5R6V
R113 R123 R133 R143 R153 R163 = CRCW0805100KJNECC: Resistor; Manufacturer_Name: Vishay; Datasheet Link: https://www.arrow.com/en/products/crcw0805100kjnecc/vishay?region=nac; Height: 0.5mm; Manufacturer_Part_Number: CRCW0805100KJNECC
R114 R124 R134 R144 R154 R164 = RL1220S-1R0-F: RES SMD 1 OHM 1% 1/3W 0805; Manufacturer: Susumu; Power (Watts): 0.333W, 1/3W; Resistance: 1 Ohms; Temperature Coefficient: 0/ +200ppm/°C; Part Number: RL1220S-1R0-F; Value: 1R; ComponentLink1Description: Datasheet; ComponentLink1URL: http://www.susumu.co.jp/common/pdf/n_catalog_partition08_en.pdf; ComponentLink2Description: DigiKey Link; ComponentLink2URL: https://www.digikey.com/en/products/detail/susumu/RL1220S-1R0-F/432493; Composition: Thin Film; Device Package: 0805 (2012 Metric); Features: Current Sense; Height - Seated (Max): 0.020" (0.50mm); LastUpdated: 31.03.2022 9:16:45; Lifecycle Status: Active; Minimum Order: 1; Number of Terminations: 2; Operating Temperature: -55°C ~ 125°C; Package / Case: 0805 (2012 Metric); Packaging: TapeAndReel; PartId: 28053; Part Status: Active; Price: 0.03; Series: RL; Size / Dimension: 0.079" L x 0.049" W (2.00mm x 1.25mm); Supplier 1: DigiKey; Supplier Part Number 1: RL12S1.00FCT-ND; Supplier Device Package: 0805; Tolerance: ±1%
R125 R145 R165 = CRE2512-FZ-R002E-3: Resistor; Manufacturer_Name: Bourns; Datasheet Link: https://datasheet.datasheetarchive.com/originals/distributors/DKDS-12/224775.pdf; Height: 0.9mm; Manufacturer_Part_Number: CRE2512-FZ-R002E-3
R311 R321 R331 = RC0805JR-0710KL: RES 10K OHM 5% 1/8W 0805; Manufacturer: Yageo; Power (Watts): 0.125W, 1/8W; Resistance: 10 kOhms; Temperature Coefficient: ±100ppm/°C; Part Number: RC0805JR-0710KL; Value: 10k; ComponentLink1Description: Datasheet; ComponentLink1URL: https://www.yageo.com/upload/media/product/productsearch/datasheet/rchip/PYu-RC_Group_51_RoHS_L_10.pdf; ComponentLink2Description: DigiKey Link; ComponentLink2URL: https://www.digikey.com/en/products/detail/yageo/RC0805JR-0710KL/728241; Composition: Thick Film; Device Package: 0805 (2012 Metric); Features: Moisture Resistant; Height - Seated (Max): 0.024" (0.60mm); LastUpdated: 02.04.2022 6:26:04; Lifecycle Status: Active; Minimum Order: 1; Number of Terminations: 2; Operating Temperature: -55°C ~ 155°C; Package / Case: 0805 (2012 Metric); Packaging: CutTape; PartId: 38737; Part Status: Active; Price: 0.01; Series: RC_L; Size / Dimension: 0.079" L x 0.049" W (2.00mm x 1.25mm); Supplier 1: DigiKey; Supplier Part Number 1: 311-10KARCT-ND; Supplier Device Package: 0805; Tolerance: ±5%
R312 R322 R332 R412 R422 R432 R621 R712 R714 R715 R912 R922 R932 = RC0805FR-0710KL: RES 10K OHM 1% 1/8W 0805; Manufacturer: Yageo; Power (Watts): 0.125W, 1/8W; Resistance: 10 kOhms; Temperature Coefficient: ±100ppm/°C; Part Number: RC0805FR-0710KL; Value: 10 k; ComponentLink1Description: Datasheet; ComponentLink1URL: https://www.yageo.com/upload/media/product/productsearch/datasheet/rchip/PYu-RC_Group_51_RoHS_L_10.pdf; ComponentLink2Description: DigiKey Link; ComponentLink2URL: https://www.digikey.com/en/products/detail/yageo/RC0805FR-0710KL/727535; Composition: Thick Film; Device Package: 0805 (2012 Metric); Features: Moisture Resistant; Height - Seated (Max): 0.024" (0.60mm); LastUpdated: 12.04.2022 22:39:34; Lifecycle Status: Active; Minimum Order: 1; Number of Terminations: 2; Operating Temperature: -55°C ~ 155°C; Package / Case: 0805 (2012 Metric); Packaging: TapeAndReel; PartId: 46046; Part Status: Active; Price: 0.01; Series: RC_L; Size / Dimension: 0.079" L x 0.049" W (2.00mm x 1.25mm); Supplier 1: DigiKey; Supplier Part Number 1: 311-10.0KCRCT-ND; Supplier Device Package: 0805; Tolerance: ±1%
R313 R323 R333 = RC0805FR-074K7P: RES SMD 4.7K OHM 1% 1/8W 0805; Manufacturer: Yageo; Power (Watts): 0.125W, 1/8W; Temperature Coefficient: ±100ppm/°C; Part Number: RC0805FR-074K7P; Value: 4.7 kOhms; ComponentLink1Description: Datasheet; ComponentLink1URL: http://www.yageo.com/NewPortal/yageodocoutput?fileName=/pdf/R-Chip/PYu-RC_51_RoHS_P_0.pdf; ComponentLink2Description: DigiKey Link; ComponentLink2URL: http://digikey.com/product-detail/en/yageo/RC0805FR-074K7P/YAG1325CT-ND/4935438; Composition: Thick Film; Device Package: 0805 (2012 Metric); Features: Moisture Resistant; Height - Seated (Max): 0.024" (0.60mm); LastUpdated: 02.04.2022 6:26:48; Lifecycle Status: Active; Minimum Order: 1; Number of Terminations: 2; Operating Temperature: -55°C ~ 155°C; Package / Case: 0805 (2012 Metric); Packaging: TapeAndReel; PartId: 27895; Part Status: Active; Price: 0.01; Resistance: 4.7 kOhms; Series: RC-P Lead Free; Size / Dimension: 0.079" L x 0.049" W (2.00mm x 1.25mm); Supplier 1: DigiKey; Supplier Part Number 1: YAG1325CT-ND; Supplier Device Package: 0805; Tolerance: ±1%
R314 R324 R334 R411 R421 R431 = RC0805FR-071K8L: RES 1.8K OHM 1% 1/8W 0805; Manufacturer: Yageo; Power (Watts): 0.125W, 1/8W; Temperature Coefficient: ±100ppm/°C; Part Number: RC0805FR-071K8L; Value: 1.8 kOhms; ComponentLink1Description: Datasheet; ComponentLink1URL: https://www.yageo.com/upload/media/product/productsearch/datasheet/rchip/PYu-RC_Group_51_RoHS_L_10.pdf; ComponentLink2Description: DigiKey Link; ComponentLink2URL: https://www.digikey.com/en/products/detail/yageo/RC0805FR-071K8L/727520; Composition: Thick Film; Device Package: 0805 (2012 Metric); Features: Moisture Resistant; Height - Seated (Max): 0.024" (0.60mm); LastUpdated: 12.04.2022 22:39:59; Lifecycle Status: Active; Minimum Order: 1; Number of Terminations: 2; Operating Temperature: -55°C ~ 155°C; Package / Case: 0805 (2012 Metric); Packaging: TapeAndReel; PartId: 39517; Part Status: Active; Price: 0.01; Resistance: 1.8 kOhms; Series: RC_L; Size / Dimension: 0.079" L x 0.049" W (2.00mm x 1.25mm); Supplier 1: DigiKey; Supplier Part Number 1: 311-1.80KCRCT-ND; Supplier Device Package: 0805; Tolerance: ±1%
R531 R911 R921 R931 = RT0805FRE0756KL: RES SMD 56K OHM 1% 1/8W 0805; Manufacturer: Yageo; Power (Watts): 0.125W, 1/8W; Temperature Coefficient: ±50ppm/°C; Part Number: RT0805FRE0756KL; Value: 56 kOhms; ComponentLink1Description: Datasheet; ComponentLink1URL: https://www.yageo.com/upload/media/product/productsearch/datasheet/rchip/PYu-RT_1-to-0.01_RoHS_L_12.pdf; ComponentLink2Description: DigiKey Link; ComponentLink2URL: https://www.digikey.com/en/products/detail/yageo/RT0805FRE0756KL/1079322; Composition: Thin Film; Device Package: 0805 (2012 Metric); Height - Seated (Max): 0.024" (0.60mm); LastUpdated: 12.04.2022 22:38:52; Lifecycle Status: Active; Minimum Order: 1; Number of Terminations: 2; Operating Temperature: -55°C ~ 155°C; Package / Case: 0805 (2012 Metric); Packaging: TapeAndReel; PartId: 61063; Part Status: Active; Price: 0.01; Resistance: 56 kOhms; Series: RT; Size / Dimension: 0.079" L x 0.049" W (2.00mm x 1.25mm); Supplier 1: DigiKey; Supplier Part Number 1: 13-RT0805FRE0756KLCT-ND; Supplier Device Package: 0805; Tolerance: ±1%
R532 = ERA-6AED273V: RES 27K OHM 0.5% 1/8W 0805; Manufacturer: Panasonic Electronic Components; Power (Watts): 0.125W, 1/8W; Temperature Coefficient: ±25ppm/°C; Part Number: ERA-6AED273V; Value: 27 kOhms; ComponentLink1Description: Datasheet; ComponentLink1URL: https://industrial.panasonic.com/cdbs/www-data/pdf/RDM0000/AOA0000C307.pdf; ComponentLink2Description: DigiKey Link; ComponentLink2URL: https://www.digikey.com/en/products/detail/panasonic-electronic-components/ERA-6AED273V/3481348; Composition: Thin Film; Device Package: 0805 (2012 Metric); Features: Automotive AEC-Q200; Height - Seated (Max): 0.024" (0.60mm); LastUpdated: 12.04.2022 22:39:40; Lifecycle Status: Active; Minimum Order: 1; Number of Terminations: 2; Operating Temperature: -55°C ~ 155°C; Package / Case: 0805 (2012 Metric); Packaging: TapeAndReel; PartId: 44422; Part Status: Active; Price: 0.01; Ratings: AEC-Q200; Resistance: 27 kOhms; Series: ERA-6A; Size / Dimension: 0.079" L x 0.049" W (2.00mm x 1.25mm); Supplier 1: DigiKey; Supplier Part Number 1: P27KBNCT-ND; Supplier Device Package: 0805; Tolerance: ±0.5%
R711 = CMP-1013-00405-1: 120R 0.125W 1% 0805 (2012 Metric)  SMD; Case-Metric: 2012; Case-EIA: 0805; Value: 120.00 Ohm; Tolerance: 1 %; Technology: SMT; Power: 0.125 W
R811 R812 R822 R823 = CR0805-JW-471ELF: RES SMD 470 OHM 5% 1/8W 0805; Manufacturer: Bourns Inc.; Power (Watts): 0.125W, 1/8W; Temperature Coefficient: ±200ppm/°C; Part Number: CR0805-JW-471ELF; Value: 470 Ohms; ComponentLink1Description: Datasheet; ComponentLink1URL: https://www.bourns.com/docs/Product-Datasheets/CHPREZTR.pdf; ComponentLink2Description: DigiKey Link; ComponentLink2URL: https://www.digikey.com/en/products/detail/bourns-inc/CR0805-JW-471ELF/3785327; Composition: Thick Film; Device Package: 0805 (2012 Metric); Features: Moisture Resistant; Height - Seated (Max): 0.024" (0.60mm); LastUpdated: 12.04.2022 22:40:02; Lifecycle Status: Active; Minimum Order: 1; Number of Terminations: 2; Operating Temperature: -55°C ~ 155°C; Package / Case: 0805 (2012 Metric); Packaging: CutTape; PartId: 38815; Part Status: Active; Price: 0.01; Resistance: 470 Ohms; Series: CR0805; Size / Dimension: 0.079" L x 0.049" W (2.00mm x 1.25mm); Supplier 1: DigiKey; Supplier Part Number 1: 118-CR0805-JW-471ELFCT-ND; Supplier Device Package: 0805; Tolerance: ±5%
STM_Morpho_19x2 = MorphoConnector_L
STM_Morpho_19x2_R = MorphoConnector_R